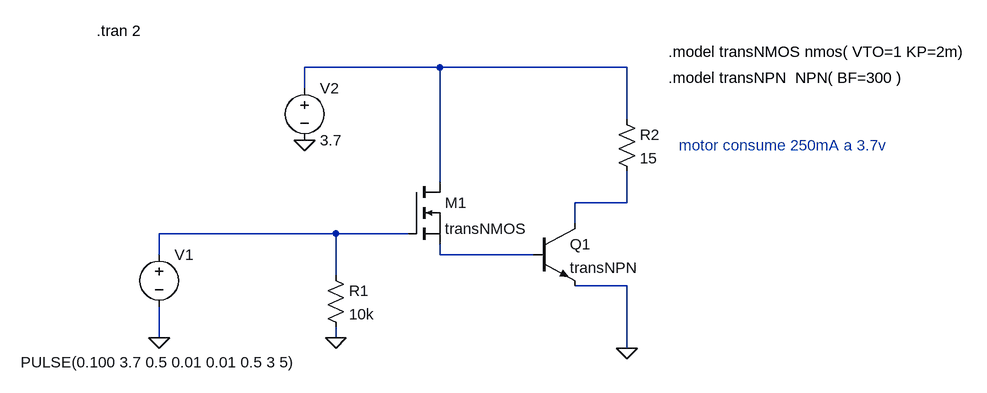
[diagram p0: schematic TL4.asc]
TL4.asc, the LTspice schematic file:
Version 4
SHEET 1 1296 680
WIRE 336 -176 128 -176
WIRE 624 -176 336 -176
WIRE 128 -144 128 -176
WIRE 624 -96 624 -176
WIRE 336 0 336 -176
WIRE 624 32 624 -16
WIRE 624 32 544 32
WIRE 544 64 544 32
WIRE 176 80 -96 80
WIRE 288 80 176 80
WIRE -96 112 -96 80
WIRE 336 112 336 96
WIRE 480 112 336 112
WIRE 176 144 176 80
WIRE 624 160 544 160
WIRE -96 240 -96 192
WIRE 176 240 176 224
WIRE 624 256 624 160
FLAG -96 240 0
FLAG 176 240 0
FLAG 128 -64 0
FLAG 624 256 0
SYMBOL voltage -96 96 R0
WINDOW 3 -213 182 Left 2
WINDOW 123 0 0 Left 2
WINDOW 39 0 0 Left 2
SYMATTR Value PULSE(0.100 3.7 0.5 0.01 0.01 0.5 3 5)
SYMATTR InstName V1
SYMBOL res 160 128 R0
SYMATTR InstName R1
SYMATTR Value 10k
SYMBOL npn 480 64 R0
SYMATTR InstName Q1
SYMATTR Value transNPN
SYMBOL nmos 288 0 R0
SYMATTR InstName M1
SYMATTR Value transNMOS
SYMBOL voltage 128 -160 R0
WINDOW 123 0 0 Left 2
WINDOW 39 0 0 Left 2
SYMATTR InstName V2
SYMATTR Value 3.7
SYMBOL res 608 -112 R0
SYMATTR InstName R2
SYMATTR Value 15
TEXT -192 -232 Left 2 !.tran 2
TEXT 688 -200 Left 2 !.model transNMOS nmos( VTO=1 KP=2m)
TEXT 704 -56 Left 2 ;motor consume 250mA a 3.7v
TEXT 688 -160 Left 2 !.model transNPN  NPN( BF=300 )

The netlist it stands for:
* TL4.asc
V1 N003 0 PULSE(0.100 3.7 0.5 0.01 0.01 0.5 3 5)
R1 N003 0 10k
Q1 N002 N004 0 0 transNPN
M1 N001 N003 N004 N004 transNMOS
V2 N001 0 3.7
R2 N001 N002 15
.model NPN NPN
.model PNP PNP
.lib standard.bjt
.model NMOS NMOS
.model PMOS PMOS
.lib standard.mos
.tran 2
.model transNMOS nmos( VTO=1 KP=2m)
* motor consume 250mA a 3.7v
.model transNPN  NPN( BF=300 )
.backanno
.end